# EAGLE design uv-exposure-box-display-v2 (EAGLE 6.4)
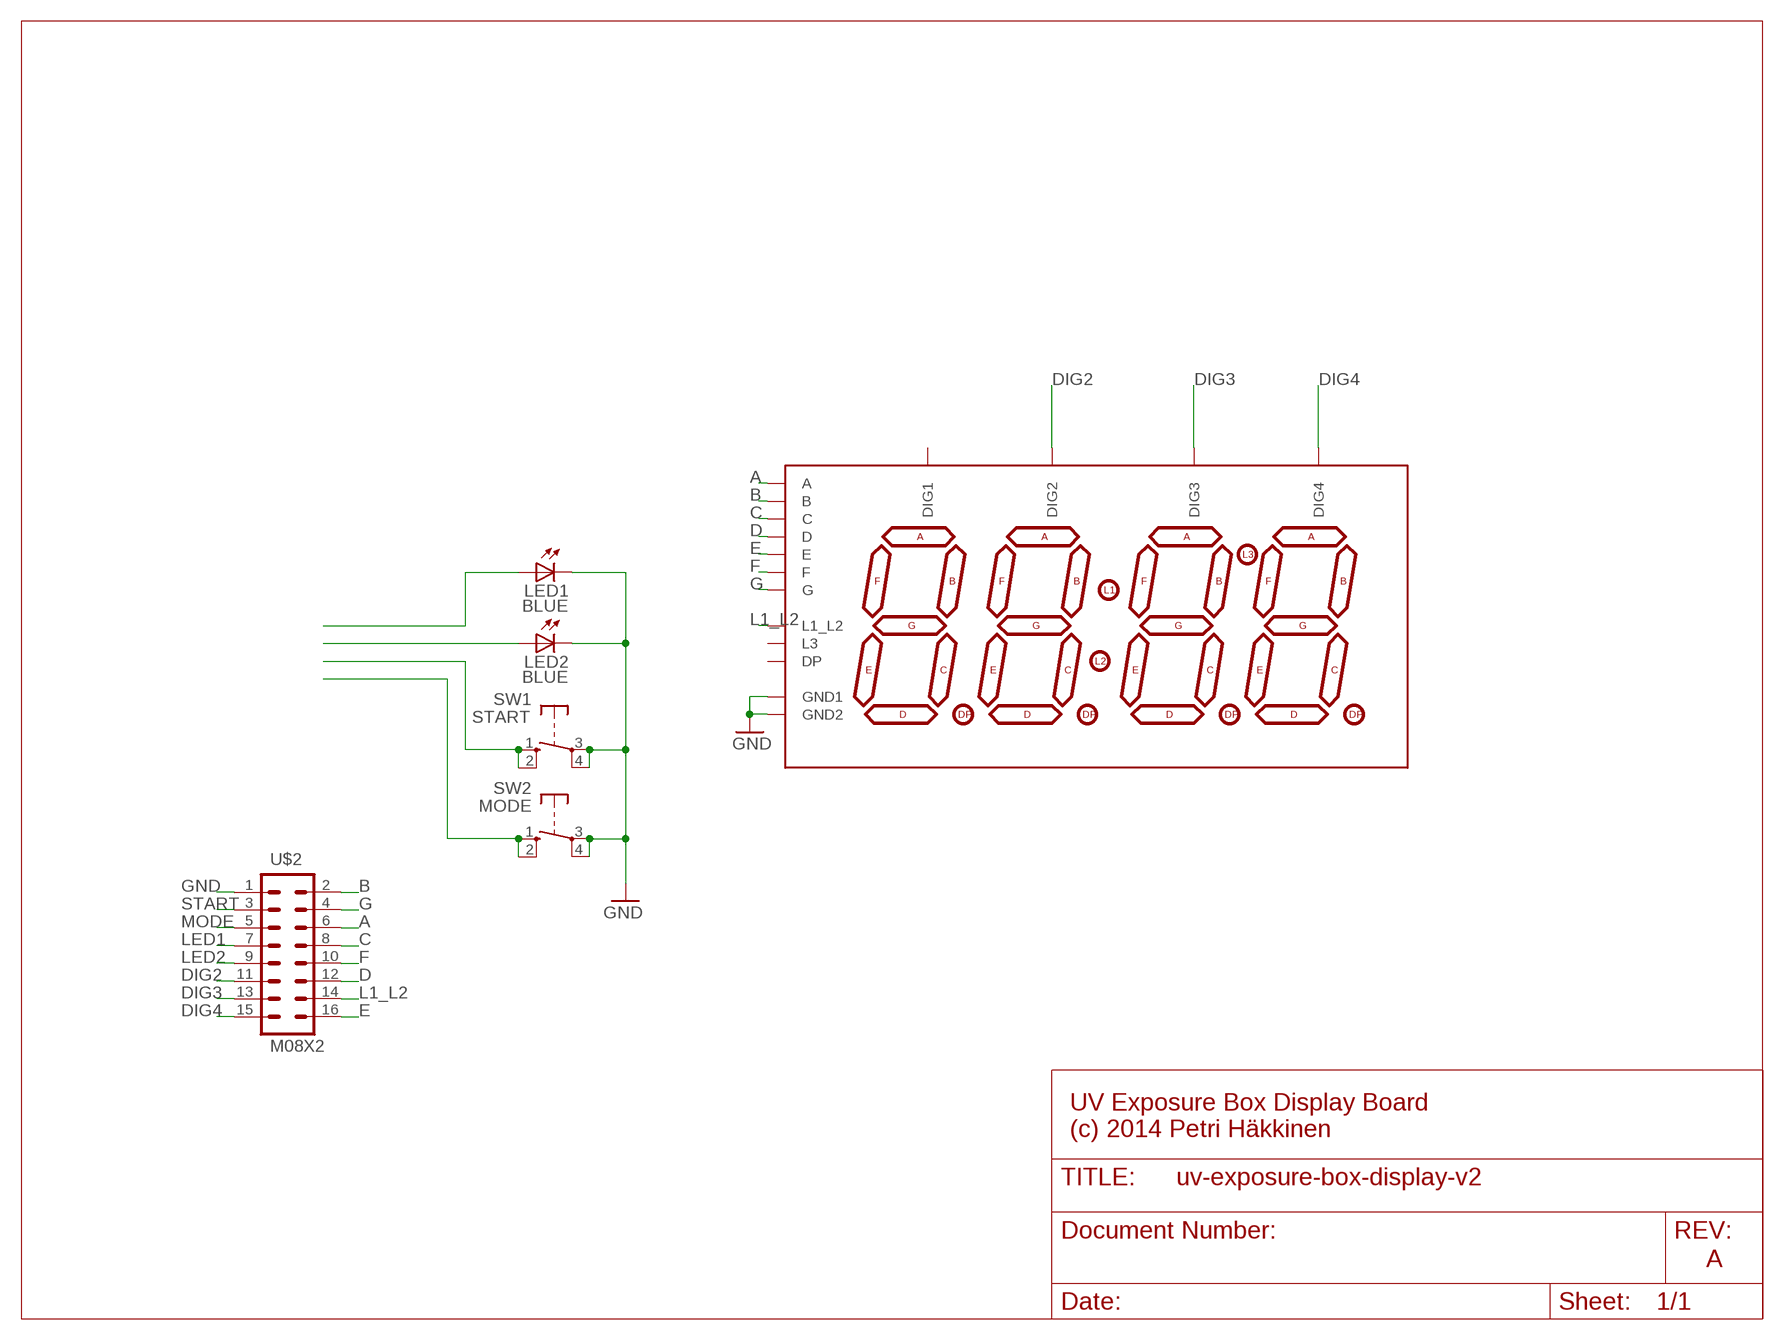
[diagram p0: schematic, sheet 1]

## Parts
LED1  BLUE  LED3MM  [LED3MM]
LED2  BLUE  LED3MM  [LED3MM]
SW1  START  DTE6K  [DTE6K]
SW2  MODE  DTE6K  [DTE6K]
U$1  7-SEGMENT-4DIGIT  [7-SEGMENT-4DIGIT-YOUNGSUN]
U$2  M08X2  [2X8]

## Nets
A: U$1.14(A) U$2.6
B: U$1.16(B) U$2.2
C: U$1.13(C) U$2.8
D: U$1.3(D) U$2.12
DIG2: U$1.2(DIG2) U$2.11
DIG3: U$1.6(DIG3) U$2.13
DIG4: U$1.8(DIG4) U$2.15
E: U$1.5(E) U$2.16
F: U$1.11(F) U$2.10
G: U$1.15(G) U$2.4
GND: LED1.K(C) LED2.K(C) SW1.3(P) SW1.4(P) SW2.3(P) SW2.4(P) U$1.9(GND1) U$1.12(GND2) U$2.1
L1_L2: U$1.4(L1_L2) U$2.14
LED1: LED1.A U$2.7
LED2: LED2.A U$2.9
MODE: SW2.1(S) SW2.2(S) U$2.5
START: SW1.1(S) SW1.2(S) U$2.3
Unconnected: U$1.1(DIG1) U$1.7(DP) U$1.10(L3)

## Notes on the sheet
- UV Exposure Box Display Board
  (c) 2014 Petri Häkkinen
- A

## Library data of the parts
LED1 LED2 = SparkFun-LED:LED: LEDs Standard schematic elements and footprints for 5mm, 3mm, 1206, and 0603 sized LEDs. 5mm - Spark Fun Electronics SKU : COM-00529 (and others)
SW1 SW2 = switch-misc:DT: ITT SWITCH
U$1 = PetenPaja:7-SEGMENT-4DIGIT
U$2 = SparkFun-Connectors:M08X2: .1" headers, two rows of 8 each

## Board
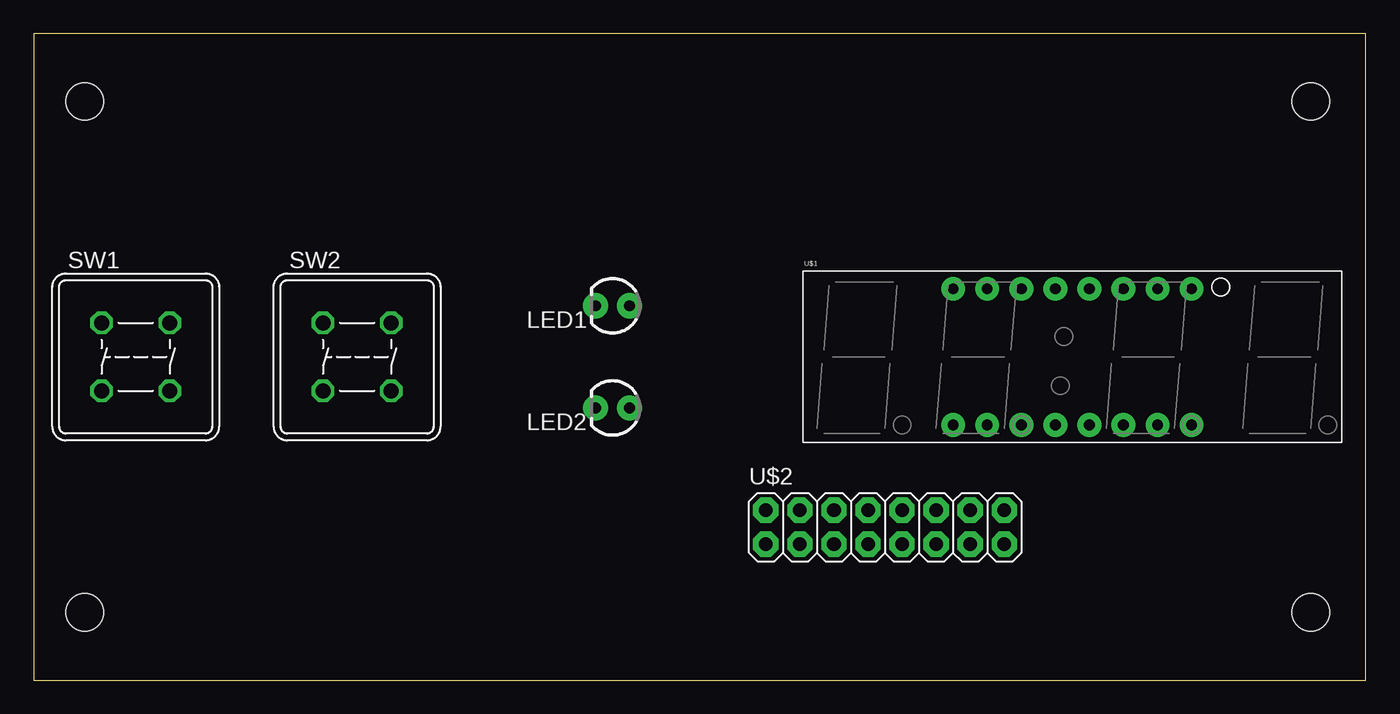
[diagram p1: board, top side]
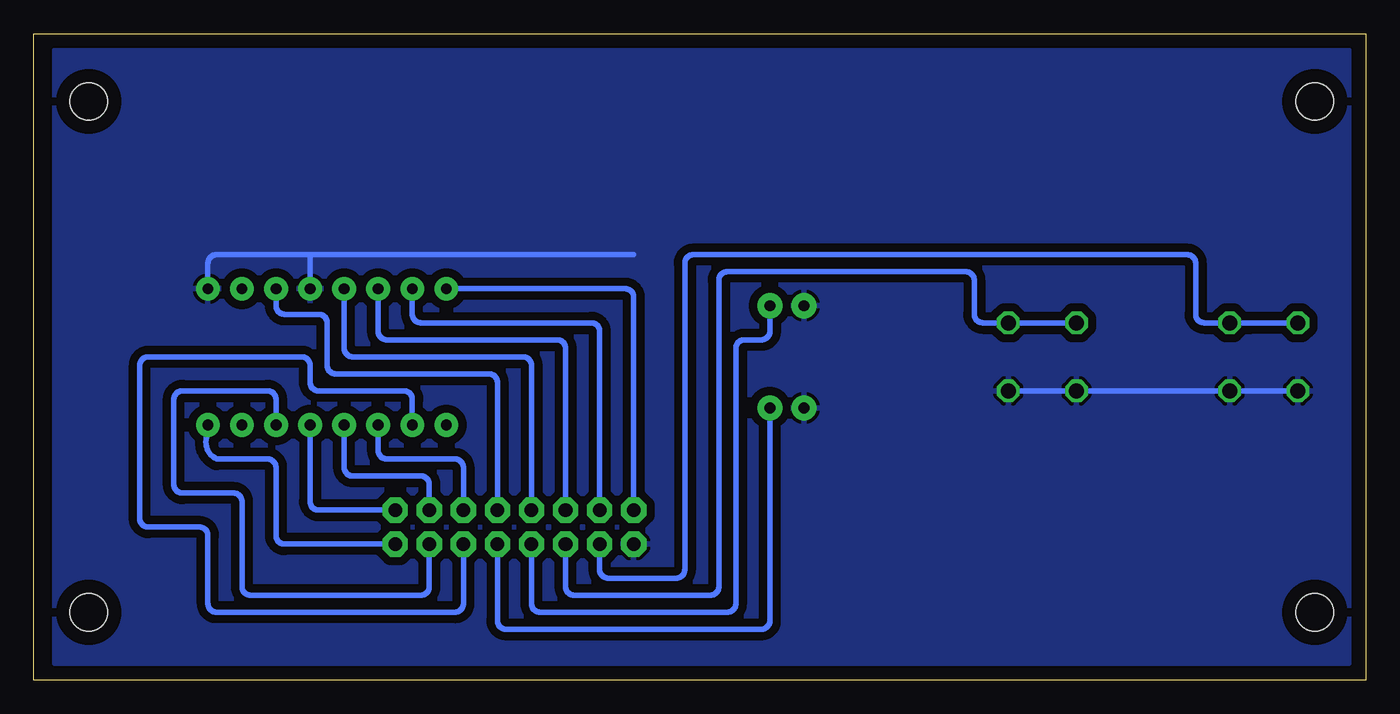
[diagram p2: board, bottom side, seen from below]

Size 99.36 x 48.25 mm. Coordinates in mm from the lower left corner, seen from the top.
Outline: 0,0 99.36,0 99.36,48.25 0,48.25 0,0
Copper layers (1*16): Top 0.035mm / dielectric 1.5mm / Bottom 0.035mm
Design rules "default": minimum track width 10mil, minimum drill 24mil, track to track 8mil, track to pad 8mil, pad to pad 8mil, via to via 8mil, smd to smd 8mil, copper to edge 40mil, drill to drill 8mil, minimum pad ring 10mil, minimum via ring 8mil, stop-mask expansion 4mil, vias tented up to drill 0mil, thermal gap 10mil
Holes 2.8 mm at 3.81,43.18 3.81,5.08 95.25,5.08 95.25,43.18

### Footprints (pad centres in the part's own frame; a part is rotated, then mirrored left to right if it is on the bottom)
LED3MM = drill 0.813 pad 1.88: A -1.27,0; K 1.27,0
DTE6K = drill 1.118 octagon: 1 -2.54,2.54; 2 2.54,2.54; 3 2.54,-2.54; 4 -2.54,-2.54
7-SEGMENT-4DIGIT-YOUNGSUN = drill 0.8 pad 1.778: 1 -8.89,-5.08; 2 -6.35,-5.08; 3 -3.81,-5.08; 4 -1.27,-5.08; 5 1.27,-5.08; 6 3.81,-5.08; 7 6.35,-5.08; 8 8.89,-5.08; 9 8.89,5.08; 10 6.35,5.08; 11 3.81,5.08; 12 1.27,5.08; 13 -1.27,5.08; 14 -3.81,5.08; 15 -6.35,5.08; 16 -8.89,5.08
2X8 = drill 1.016 pad 1.88 octagon: 1 0,0; 2 0,2.54; 3 2.54,0; 4 2.54,2.54; 5 5.08,0; 6 5.08,2.54; 7 7.62,0; 8 7.62,2.54; 9 10.16,0; 10 10.16,2.54; 11 12.7,0; 12 12.7,2.54; 13 15.24,0; 14 15.24,2.54; 15 17.78,0; 16 17.78,2.54

### Placement (x,y rotation side)
LED1  43.18,27.94 180 top
LED2  43.18,20.32 180 top
SW1  7.62,24.13 0 top
SW2  24.13,24.13 0 top
U$1  77.47,24.13 0 top
U$2  54.61,10.16 0 top

### Tracks (layer width: path | path; a pad name or v marks a point on that pad's centre or on a via)
A
  Bottom 0.406: U$2.6 59.69,24.77 arc-90 60.33,25.4 73.02,25.4 arc90 73.66,26.04 U$1.14
B
  Bottom 0.406: U$1.16 55.24,29.21 arc90 54.61,28.57 U$2.2
C
  Bottom 0.406: U$2.8 62.23,23.5 arc-90 62.86,24.13 75.56,24.13 arc90 76.2,24.77 U$1.13
D
  Bottom 0.406: U$1.3 73.66,17.14 arc-90 73.02,16.51 67.94,16.51 arc90 67.31,15.88 U$2.12
DIG2
  Bottom 0.406: U$1.2 71.12,20.95 arc-90 71.75,21.59 78.11,21.59 arc90 78.74,22.22 78.74,23.5 arc-90 79.38,24.13 90.8,24.13 arc-90 91.44,23.5 91.44,12.06 arc-90 90.8,11.43 87,11.43 arc90 86.36,10.79 86.36,5.71 arc-90 85.72,5.08 67.94,5.08 arc-90 67.31,5.71 U$2.11
DIG3
  Bottom 0.406: U$2.13 69.85,6.98 arc90 70.48,6.35 83.19,6.35 arc90 83.82,6.98 83.82,13.33 arc-90 84.45,13.97 88.27,13.97 arc90 88.9,14.61 88.9,20.95 arc90 88.27,21.59 81.91,21.59 arc90 81.28,20.95 U$1.6
DIG4
  Bottom 0.406: U$2.15 80.64,10.16 arc90 81.28,10.79 81.28,15.88 arc-90 81.91,16.51 85.72,16.51 arc90 86.36,18.41 U$1.8
E
  Bottom 0.406: U$1.5 78.74,13.33 arc-90 78.11,12.7 U$2.16
F
  Bottom 0.406: U$2.10 64.77,22.22 arc-90 65.41,22.86 76.83,22.86 arc90 77.47,23.5 77.47,26.67 arc-90 78.11,27.3 80.64,27.3 arc90 81.28,27.94 U$1.11
G
  Bottom 0.406: U$2.4 57.15,26.04 arc-90 57.78,26.67 70.48,26.67 arc90 71.12,27.3 U$1.15
GND
  Bottom 0.406: U$1.9 86.36,31.11 arc90 85.72,31.75 78.74,31.75 | 78.74,31.75 U$1.12 | SW2.4 SW2.3 SW1.4 SW1.3 | 54.61,31.75 78.74,31.75 | U$2.1 55.24,10.16 arc-90 54.61,10.79
  pour Bottom (isolate 0.61): 1.27,46.99 97.79,46.99 97.79,1.27 1.27,1.27
L1_L2
  Bottom 0.406: U$2.14 69.85,14.61 arc-90 70.48,15.24 75.56,15.24 arc90 76.2,15.88 U$1.4
LED1
  Bottom 0.406: LED1.A 44.45,26.04 arc90 45.09,25.4 46.35,25.4 arc-90 46.99,24.77 46.99,5.71 arc90 47.62,5.08 61.59,5.08 arc90 62.23,5.71 U$2.7
LED2
  Bottom 0.406: U$2.9 64.77,4.45 arc-90 64.13,3.81 45.09,3.81 arc-90 44.45,4.45 LED2.A
MODE
  Bottom 0.406: SW2.1 SW2.2 | SW2.2 28.57,26.67 arc90 29.21,27.3 29.21,29.84 arc-90 29.85,30.48 47.62,30.48 arc-90 48.26,29.84 48.26,6.98 arc90 48.89,6.35 59.05,6.35 arc90 59.69,6.98 U$2.5 | SW2.2 22.23,26.67
N$1
  pour Bottom (isolate 0.61): 1.27,46.99 97.79,46.99 97.79,1.27 1.27,1.27
START
  Bottom 0.406: SW1.1 SW1.2 | SW1.2 12.06,26.67 arc90 12.7,27.3 12.7,31.11 arc-90 13.33,31.75 50.16,31.75 arc-90 50.8,31.11 50.8,8.26 arc90 51.43,7.62 56.52,7.62 arc90 57.15,8.26 U$2.3 | SW1.2 8.53,26.67